# Altium schematic sheet MCU.SchDoc
size A4
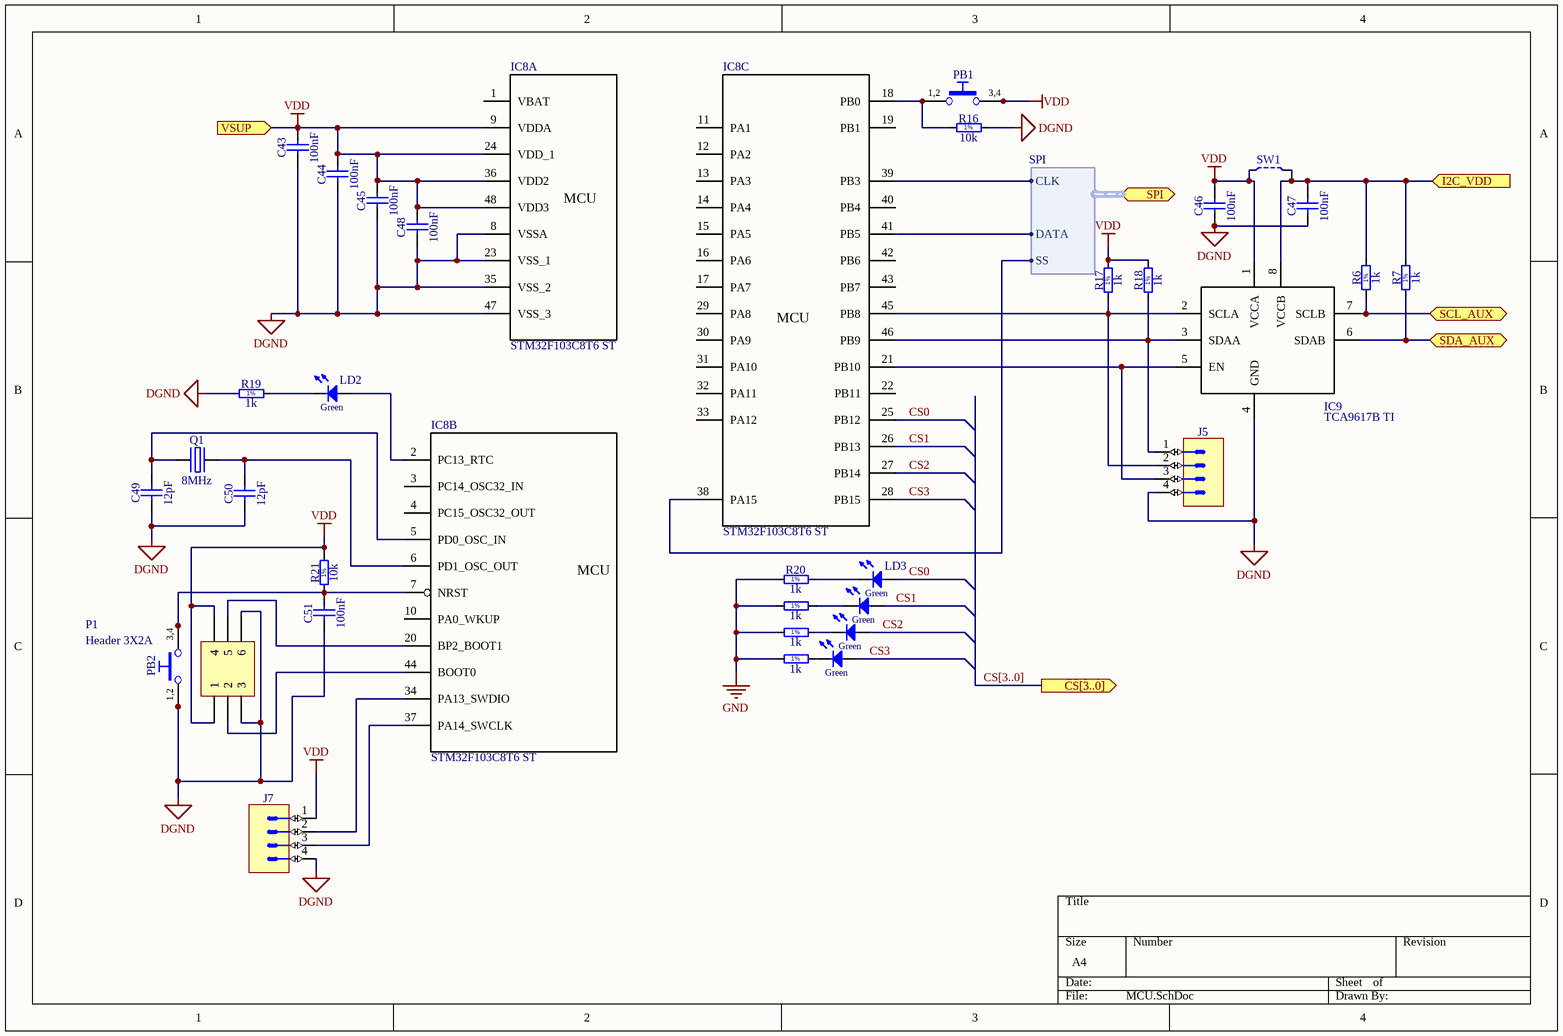
[diagram p0: MCU.SchDoc]

## Parts
C43  100nF  [CAPC2012X135N]
C44  100nF  [CAPC2012X135N]
C45  100nF  [CAPC2012X135N]
C46  100nF  [CAPC2012X135N]
C47  100nF  [CAPC2012X135N]
C48  100nF  [CAPC2012X135N]
C49  12pF  [CAPC2012X135N]
C50  12pF  [CAPC2012X135N]
C51  100nF  [CAPC2012X135N]
IC8  STM32F103C8T6 ST  [QFP50P900X900X160-48N]  (parts A,B,C of 3)
IC9  TCA9617B TI  [TSOP65P490X110-8N]
J5  Header 4  [PRECI-DIP_350-V3-104-00-001101]  (value not drawn)
J7  Header 4  [PRECI-DIP_350-V3-104-00-001101]  (value not drawn)
LD2  Green  [LED_OSRAM_LGR971]  (value not drawn)
LD3  Green  [LED_OSRAM_LGR971]  (value not drawn)
LD4  Green  [LED_OSRAM_LGR971]  (value not drawn)
LD5  Green  [LED_OSRAM_LGR971]  (value not drawn)
LD6  Green  [LED_OSRAM_LGR971]  (value not drawn)
P1  Header 3X2A  [HDR2X3_CEN]
PB1  Push Button  [PB_OMRON_B3F-1000]  (value not drawn)
PB2  Push Button  [PB_OMRON_B3F-1000]  (value not drawn)
Q1  8MHz  [XTAL_TXC_7A]
R6  1k  [RESC2012X60N]
R7  1k  [RESC2012X60N]
R16  10k  [RESC2012X60N]
R17  1k  [RESC2012X60N]
R18  1k  [RESC2012X60N]
R19  1k  [RESC2012X60N]
R20  1k  [RESC2012X60N]
R21  10k  [RESC2012X60N]
R22  1k  [RESC2012X60N]
R23  1k  [RESC2012X60N]
R24  1k  [RESC2012X60N]
SW1  Switch  [JUMPSMD0805_G50]  (value not drawn)

## Ports
CS[3..0] (out), I2C_VDD (in), SCL_AUX (bidir), SDA_AUX (bidir), SPI (bidir, harness SPI), VSUP (in)

## Harnesses
SPI: DATA, CLK, SS

## Nets
DGND: C43.1 C44.1 C45.1 C46.1 C47.1 C48.1 C49.1 C50.1 C51.1 IC8.8(VSSA) IC8.23(VSS_1) IC8.35(VSS_2) IC8.47(VSS_3) IC9.4(GND) J5.4 J7.4 P1.3 P1.6 PB2.1 PB2.2 R16.2 R19.1
GND: R20.1 R22.1 R23.1 R24.1
VDD: C43.2 C44.2 C45.2 C46.2 C48.2 IC8.9(VDDA) IC8.24(VDD_1) IC8.36(VDD2) IC8.48(VDD3) IC9.1(VCCA) J7.1 P1.1 P1.4 PB1.3 PB1.4 R17.2 R18.2 R21.2 SW1.1 ; port VSUP
CS0: IC8.25(PB12) LD3.2(A)
CS1: IC8.26(PB13) LD4.2(A)
CS2: IC8.27(PB14) LD5.2(A)
CS3: IC8.28(PB15) LD6.2(A)
I2C_VDD: C47.2 IC9.8(VCCB) R6.2 R7.2 SW1.2 ; port I2C_VDD
SCL_AUX: IC9.7(SCLB) R6.1 ; port SCL_AUX
SDA_AUX: IC9.6(SDAB) R7.1 ; port SDA_AUX
NetC49_2: C49.2 IC8.5(PD0_OSC_IN) Q1.1(OSC1)
NetC50_2: C50.2 IC8.6(PD1_OSC_OUT) Q1.2(OSC2)
NetC51_2: C51.2 IC8.7(NRST) PB2.3 PB2.4 R21.1
NetIC8_2: IC8.2(PC13_RTC) LD2.2(A)
NetIC8_18: IC8.18(PB0) PB1.1 PB1.2 R16.1
NetIC8_20: IC8.20(BP2_BOOT1) P1.5
NetIC8_21: IC8.21(PB10) IC9.5(EN) J5.3
NetIC8_34: IC8.34(PA13_SWDIO) J7.2
NetIC8_37: IC8.37(PA14_SWCLK) J7.3
NetIC8_38: IC8.38(PA15) ; port SPI.SS
NetIC8_39: IC8.39(PB3) ; port SPI.CLK
NetIC8_41: IC8.41(PB5) ; port SPI.DATA
NetIC8_44: IC8.44(BOOT0) P1.2
NetIC8_45: IC8.45(PB8) IC9.2(SCLA) J5.2 R17.1
NetIC8_46: IC8.46(PB9) IC9.3(SDAA) J5.1 R18.1
NetLD2_1: LD2.1(C) R19.2
NetLD3_1: LD3.1(C) R20.2
NetLD4_1: LD4.1(C) R22.2
NetLD5_1: LD5.1(C) R23.2
NetLD6_1: LD6.1(C) R24.2

Not connected (* = marked no-connect by the designer): IC8 1(VBAT) 3(PC14_OSC32_IN) 4(PC15_OSC32_OUT) 10(PA0_WKUP) 11(PA1) 12(PA2) 13(PA3) 14(PA4) 15(PA5) 16(PA6) 17(PA7) 19(PB1) 22(PB11) 29(PA8) 30(PA9) 31(PA10) 32(PA11) 33(PA12) 40(PB4) 42(PB6) 43(PB7)

## Buses and harness runs
bus CS[3..0] = port CS[3..0]

## Notes on the sheet
- (in symbol PB_OMRON_B3F-1000) 3,4; 1,2
- (in symbol R0805_1K_1%_0.125W_100PPM) 1%
- (in symbol R0805_10K_1%_0.125W_100PPM) 1%
- (in symbol STM32F103C8T6, part A) MCU
- (in symbol STM32F103C8T6, part B) MCU
- (in symbol STM32F103C8T6, part C) MCU

## Library data of the parts
C43-C48 C51 = CC0805_100NF_50V_10%_X7R: Non-polarised capacitor; Part Description: SMD Multilayer Chip Ceramic Capacitor; Manufacturer: GENERIC; Manufacturer1 Part Number: C2012X7R1H104K085AA; Voltage: 50V; TC: X7R; Tolerance: ±10%; Part Number: CC0805_100NF_50V_10%_X7R; Component Kind: Standard; Component Type: Standard; Pin Count: 2; Value: 100nF; Status: Preferred; Manufacturer Part Number: CC0805_100NF_50V_10%_X7R; Case: 0805; Mounted: Yes; Socket: No; SMD: Yes; Sense: No; Manufacturer1 Example: TDK; Manufacturer1 ComponentHeight: 1mm; HelpURL: \\cern.ch\dfs\Applications\Altium\Datasheets\CC0805_X7R_TDK_C.pdf; Author: CERN DEM JLC; CreateDate: 03.12.2007; LatestRevisionDate: 22.04.2015
C49 C50 = CC0805_12PF_50V_5%_NP0: Non-polarised capacitor; Part Description: SMD Multilayer Chip Ceramic Capacitor; Manufacturer: GENERIC; Manufacturer1 Part Number: 223886115129; Voltage: 50V; TC: C0G/NP0; Tolerance: ±5%; Part Number: CC0805_12PF_50V_5%_NP0; Component Kind: Standard; Component Type: Standard; Pin Count: 2; Value: 12pF; Status: Preferred; Manufacturer Part Number: CC0805_12PF_50V_5%_NP0; Case: 0805; Mounted: Yes; Socket: No; SMD: Yes; Sense: No; Manufacturer1 Example: PHYCOMP; Manufacturer1 ComponentHeight: 1.35mm; HelpURL: \\cern.ch\dfs\Applications\Altium\Datasheets\CC0805_NP0_PHYCOMP.pdf; Author: CERN DEM JLC; CreateDate: 03.12.2007; LatestRevisionDate: 03.12.2007
IC8 = STM32F103C8T6: Name: STM32F103C8T6; Manufacturer: ST
IC9 = TCA9617B: Name: TCA9617B; Manufacturer: TI
J5 J7 = PRECI-DIP_350-V3-104-00-001101: Connector 4 Male; Part Description: Pitch 2.54mm, Single Row, Straight 4 Contacts PCB Header; PressFit: No; Part Number: PRECI-DIP_350-V3-104-00-001101; Component Kind: Standard; Component Type: Standard; Pin Count: 4; Family: Header 4; Mounted: Yes; Socket: No; SMD: No; Sense: No; Status: None; Manufacturer: PRECI-DIP; Manufacturer Part Number: 350-V3-104-00-001101; ComponentHeight: 7.96mm; HelpURL: \\cern.ch\dfs\Applications\Altium\Datasheets\PRECI-DIP_350-V3-104-00-001101.pdf; Author: CERN DEM BC; CreateDate: 18.03.2016; LatestRevisionDate: 18.03.2016
LD2-LD6 = LED_OSRAM_LGR971: LED Green 1C 2A; Part Description: Surface Mount Green LED (0805 Case); Manufacturer: OSRAM; Manufacturer Part Number: LGR971; PressFit: No; Bonding: No; Part Number: LED_OSRAM_LGR971; Component Kind: Standard; Component Type: Standard; Color: Green; PackageDescription: Green Chip LED, 2-Leads, Body 2.0x1.25mm, IPC Medium Density; Pin Count: 2; Case: 0805; Mounted: Yes; Socket: No; SMD: Yes; Sense: No; ComponentHeight: 0.9mm; HelpURL: \\cern.ch\dfs\Applications\Altium\Datasheets\LED_OSRAM_LGR971.pdf; Author: CERN DEM JLC; CreateDate: 28.01.2009; LatestRevisionDate: 17.03.2010
P1 = Header 3X2A: Header, 3-Pin, Dual row; LatestRevisionDate: 17-Jul-2002; LatestRevisionNote: Re-released for DXP Platform.; Publisher: Altium Limited
PB1 PB2 = PB_OMRON_B3F-1000: Push-Button Switch SPDT; Part Description: 24VDC 50mA SPST-NO Tactile Push-Button Switch (h=4.5mm); Manufacturer: OMRON; PressFit: No; Part Number: PB_OMRON_B3F-1000; Component Kind: Standard; Component Type: Standard; Pin Count: 4; PackageDescription: 6x6mm Model, Horizontal, Flat Plunger Type (without Ground Terminal) Pushbutton Switch, OMRON B3F Series; Family: Push Button; Mounted: Yes; Socket: No; SMD: No; Sense: No; Status: None; Manufacturer Part Number: B3F-1000; ComponentHeight: 4.5mm; HelpURL: \\cern.ch\dfs\Applications\Altium\Datasheets\PB_OMRON_B3F-1000.pdf; Author: CERN DEM JMW; CreateDate: 23.10.2008; LatestRevisionDate: 06.05.2009
Q1 = XTAL_8MHZ_TXC_7A-8.000MAAE-T: Quartz Crystal; Part Description: Tolerance: ±30ppm, Stability: ±30ppm, -20°C to +70°C, 12pF, SMD Glass Seam Sealing Crystal, 7A Series; Manufacturer: TXC CORPORATION; PressFit: No; Bonding: No; Part Number: XTAL_8MHZ_TXC_7A-8.000MAAE-T; Component Kind: Standard; Component Type: Standard; PackageDescription: 2 Pins, 3.2x5mm, SMD Glass Seam Sealing Crystal, 7A Serie; Value: 8MHz; Manufacturer Part Number: 7A-8.000MAAE-T; Pin Count: 2; Mounted: Yes; Socket: No; SMD: Yes; Sense: No; ComponentHeight: 1.2mm; HelpURL: \\cern.ch\dfs\Applications\Altium\Datasheets\XTAL_TXC_7A.pdf; Author: CERN DEM JLC; CreateDate: 09.10.2014; LatestRevisionDate: 12.11.2014
R6 R7 R17-R20 R22-R24 = R0805_1K_1%_0.125W_100PPM: Resistor - 1%; Part Description: General Purpose Thick Film Chip Resistor; Manufacturer: GENERIC; Manufacturer1 Part Number: NRC10F1001TRF; Power: 0.125W; TC: ±100ppm/°C; PressFit: No; Part Number: R0805_1K_1%_0.125W_100PPM; Component Kind: Standard; Component Type: Standard; Pin Count: 2; Value: 1k; Status: Preferred; Tolerance: ±1%; Manufacturer Part Number: R0805_1K_1%_0.125W_100PPM; Case: 0805; Mounted: Yes; Sense: No; Socket: No; SMD: Yes; Manufacturer1 Example: NIC COMPONENT; Manufacturer1 ComponentHeight: 0.6mm; HelpURL: \\cern.ch\dfs\Applications\Altium\Datasheets\R0805_NIC_NRC.pdf; Author: CERN DEM JLC; CreateDate: 03.12.2007; LatestRevisionDate: 13.03.2008
R16 R21 = R0805_10K_1%_0.125W_100PPM: Resistor - 1%; Part Description: General Purpose Thick Film Chip Resistor; Manufacturer: GENERIC; Manufacturer1 Part Number: NRC10F1002TRF; Power: 0.125W; TC: ±100ppm/°C; PressFit: No; Part Number: R0805_10K_1%_0.125W_100PPM; Component Kind: Standard; Component Type: Standard; Pin Count: 2; Value: 10k; Status: Preferred; Tolerance: ±1%; Manufacturer Part Number: R0805_10K_1%_0.125W_100PPM; Case: 0805; Mounted: Yes; Sense: No; Socket: No; SMD: Yes; Manufacturer1 Example: NIC COMPONENT; Manufacturer1 ComponentHeight: 0.6mm; HelpURL: \\cern.ch\dfs\Applications\Altium\Datasheets\R0805_NIC_NRC.pdf; Author: CERN DEM JLC; CreateDate: 03.12.2007; LatestRevisionDate: 13.03.2008
SW1 = JUMPSMD0805_G50: 2 SMD Pads for Bound by Solder  Drop; Part Description: 2 SMD Pads for Bound by Solder Drop - Equivalent Size 0805 - Gap 0.5mm; Manufacturer: None; Mounted: No; PressFit: No; Part Number: JUMPSMD0805_G50; Component Kind: Standard (No BOM); Component Type: Standard (No BOM); Pin Count: 2; PackageDescription: 2 SMD Pads for Bound by Solder Drop - Equivalent Size 0805 - Gap 0.5mm; Family: Switch; Socket: No; SMD: Yes; Sense: No; Status: None; Manufacturer Part Number: None; ComponentHeight: 0mm; HelpURL: None; Author: CERN DEM JLC; CreateDate: 26.08.2009; LatestRevisionDate: 09.09.2009